# EAGLE schematic controller-teensy-4 (EAGLE 6.4)
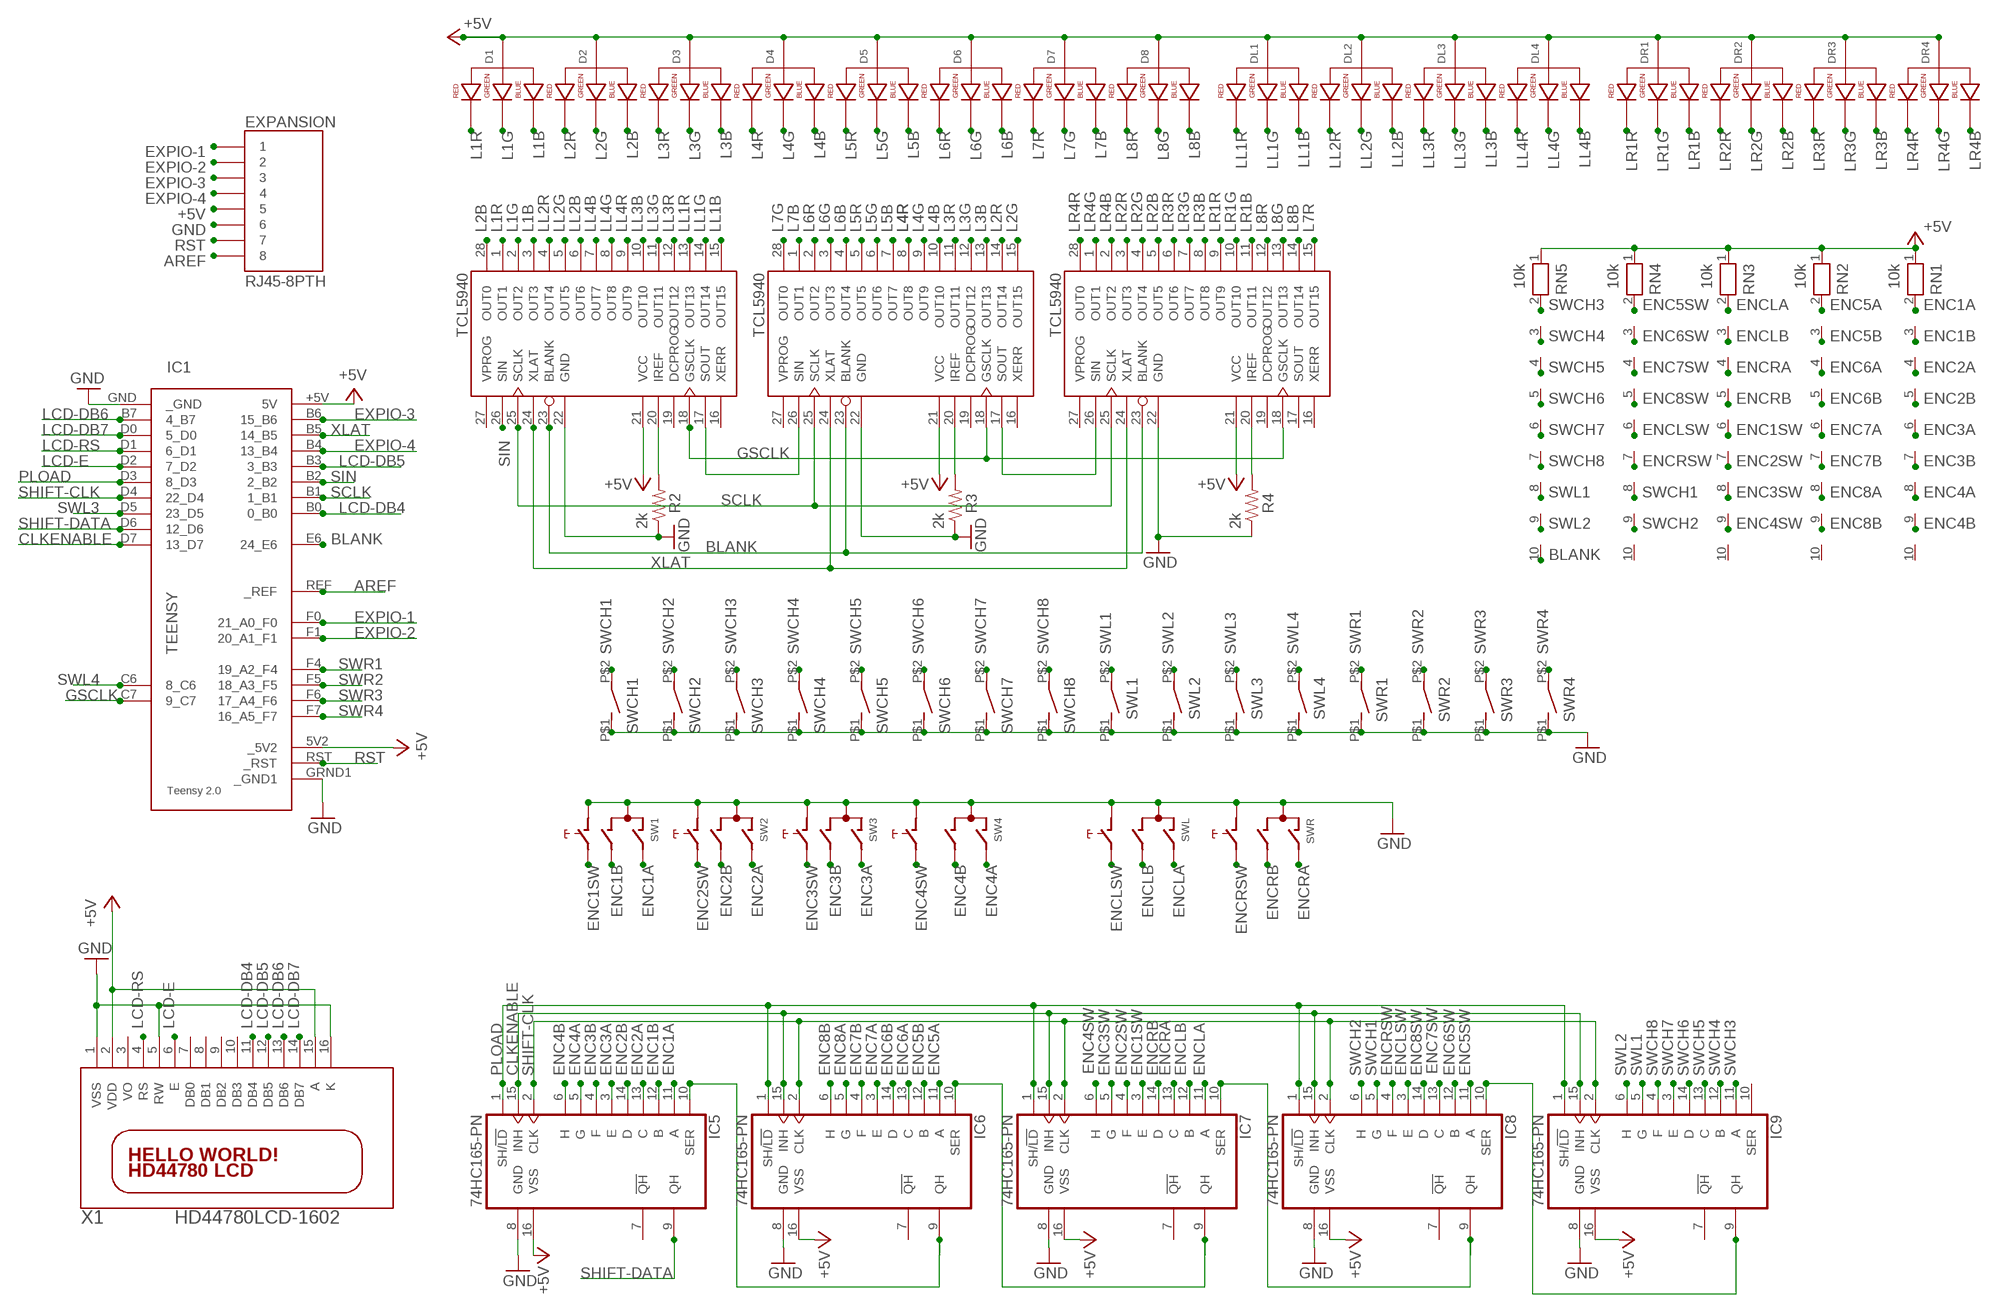
[diagram p0: schematic, sheet 1]

## Parts
D1  LED-RGB-CA-THRUDIFFUSE  [LED-RGB-THRU]
D2  LED-RGB-CA-THRUDIFFUSE  [LED-RGB-THRU]
D3  LED-RGB-CA-THRUDIFFUSE  [LED-RGB-THRU]
D4  LED-RGB-CA-THRUDIFFUSE  [LED-RGB-THRU]
D5  LED-RGB-CA-THRUDIFFUSE  [LED-RGB-THRU]
D6  LED-RGB-CA-THRUDIFFUSE  [LED-RGB-THRU]
D7  LED-RGB-CA-THRUDIFFUSE  [LED-RGB-THRU]
D8  LED-RGB-CA-THRUDIFFUSE  [LED-RGB-THRU]
DL1  LED-RGB-CA-THRUDIFFUSE  [LED-RGB-THRU]
DL2  LED-RGB-CA-THRUDIFFUSE  [LED-RGB-THRU]
DL3  LED-RGB-CA-THRUDIFFUSE  [LED-RGB-THRU]
DL4  LED-RGB-CA-THRUDIFFUSE  [LED-RGB-THRU]
DR1  LED-RGB-CA-THRUDIFFUSE  [LED-RGB-THRU]
DR2  LED-RGB-CA-THRUDIFFUSE  [LED-RGB-THRU]
DR3  LED-RGB-CA-THRUDIFFUSE  [LED-RGB-THRU]
DR4  LED-RGB-CA-THRUDIFFUSE  [LED-RGB-THRU]
EXPANSION  RJ45-8PTH  [RJ45-8]
IC1  TEENSY  [TEENSY]
IC2  LEDPWM1  TCL5940  [DIP28]
IC3  LEDPWM2  TCL5940  [DIP28]
IC4  LEDPWM3  TCL5940  [DIP28]
IC5  74HC165-PN  [DIL16]
IC6  74HC165-PN  [DIL16]
IC7  74HC165-PN  [DIL16]
IC8  74HC165-PN  [DIL16]
IC9  74HC165-PN  [DIL16]
R2  2k  R-US_0207/10  [0207/10]
R3  2k  R-US_0207/10  [0207/10]
R4  2k  R-US_0207/10  [0207/10]
RN1  10k  RN09  [RN-10]
RN2  10k  RN09  [RN-10]
RN3  10k  RN09  [RN-10]
RN4  10k  RN09  [RN-10]
RN5  10k  RN09  [RN-10]
SW1  EC12E_SW  [ALPS_EC12E_SW]
SW2  EC12E_SW  [ALPS_EC12E_SW]
SW3  EC12E_SW  [ALPS_EC12E_SW]
SW4  EC12E_SW  [ALPS_EC12E_SW]
SWCH1  BPM  [BMP]
SWCH2  BPM  [BMP]
SWCH3  BPM  [BMP]
SWCH4  BPM  [BMP]
SWCH5  BPM  [BMP]
SWCH6  BPM  [BMP]
SWCH7  BPM  [BMP]
SWCH8  BPM  [BMP]
SWL  EC12E_SW  [ALPS_EC12E_SW]
SWL1  BPM  [BMP]
SWL2  BPM  [BMP]
SWL3  BPM  [BMP]
SWL4  BPM  [BMP]
SWR  EC12E_SW  [ALPS_EC12E_SW]
SWR1  BPM  [BMP]
SWR2  BPM  [BMP]
SWR3  BPM  [BMP]
SWR4  BPM  [BMP]
X1  HD44780LCD-1602  [LCD1602]

## Nets
+5V: D1.2(ANODE) D2.2(ANODE) D3.2(ANODE) D4.2(ANODE) D5.2(ANODE) D6.2(ANODE) D7.2(ANODE) D8.2(ANODE) DL1.2(ANODE) DL2.2(ANODE) DL3.2(ANODE) DL4.2(ANODE) DR1.2(ANODE) DR2.2(ANODE) DR3.2(ANODE) DR4.2(ANODE) EXPANSION.5 IC1.5V2(_5V2) IC1.+5V(5V) IC2.21(VCC) IC3.21(VCC) IC4.21(VCC) IC5.16(VSS) IC6.16(VSS) IC7.16(VSS) IC8.16(VSS) IC9.16(VSS) RN1.1 RN2.1 RN3.1 RN4.1 RN5.1 X1.2(VDD) X1.15(A)
AREF: EXPANSION.8 IC1.REF(_REF)
BLANK: IC1.E6(24_E6) IC2.23(BLANK) IC3.23(BLANK) IC4.23(BLANK) RN5.10
CLKENABLE: IC1.D7(13_D7) IC5.15(INH) IC6.15(INH) IC7.15(INH) IC8.15(INH) IC9.15(INH)
ENC1A: IC5.11(A) RN1.2 SW1.A
ENC1B: IC5.12(B) RN1.3 SW1.B
ENC1SW: IC7.3(E) RN3.6 SW1.E
ENC2A: IC5.13(C) RN1.4 SW2.A
ENC2B: IC5.14(D) RN1.5 SW2.B
ENC2SW: IC7.4(F) RN3.7 SW2.E
ENC3A: IC5.3(E) RN1.6 SW3.A
ENC3B: IC5.4(F) RN1.7 SW3.B
ENC3SW: IC7.5(G) RN3.8 SW3.E
ENC4A: IC5.5(G) RN1.8 SW4.A
ENC4B: IC5.6(H) RN1.9 SW4.B
ENC4SW: IC7.6(H) RN3.9 SW4.E
ENC5A: IC6.11(A) RN2.2
ENC5B: IC6.12(B) RN2.3
ENC5SW: IC8.11(A) RN4.2
ENC6A: IC6.13(C) RN2.4
ENC6B: IC6.14(D) RN2.5
ENC6SW: IC8.12(B) RN4.3
ENC7A: IC6.3(E) RN2.6
ENC7B: IC6.4(F) RN2.7
ENC7SW: IC8.13(C) RN4.4
ENC8A: IC6.5(G) RN2.8
ENC8B: IC6.6(H) RN2.9
ENC8SW: IC8.14(D) RN4.5
ENCLA: IC7.11(A) RN3.2 SWL.A
ENCLB: IC7.12(B) RN3.3 SWL.B
ENCLSW: IC8.3(E) RN4.6 SWL.E
ENCRA: IC7.13(C) RN3.4 SWR.A
ENCRB: IC7.14(D) RN3.5 SWR.B
ENCRSW: IC8.4(F) RN4.7 SWR.E
EXPIO-1: EXPANSION.1 IC1.F0(21_A0_F0)
EXPIO-2: EXPANSION.2 IC1.F1(20_A1_F1)
EXPIO-3: EXPANSION.3 IC1.B6(15_B6)
EXPIO-4: EXPANSION.4 IC1.B4(13_B4)
GND: EXPANSION.6 IC1.GND(_GND) IC1.GRND1(_GND1) IC2.22(GND) IC3.22(GND) IC4.22(GND) IC5.8(GND) IC6.8(GND) IC7.8(GND) IC8.8(GND) IC9.8(GND) R2.1 R3.1 R4.1 SW1.C SW1.D SW2.C SW2.D SW3.C SW3.D SW4.C SW4.D SWCH1.P$1 SWCH2.P$1 SWCH3.P$1 SWCH4.P$1 SWCH5.P$1 SWCH6.P$1 SWCH7.P$1 SWCH8.P$1 SWL1.P$1 SWL2.P$1 SWL3.P$1 SWL4.P$1 SWL.C SWL.D SWR1.P$1 SWR2.P$1 SWR3.P$1 SWR4.P$1 SWR.C SWR.D X1.1(VSS) X1.5(RW) X1.16(K)
GSCLK: IC1.C7(9_C7) IC2.18(GSCLK) IC3.18(GSCLK) IC4.18(GSCLK)
IC6-IC5: IC5.10(SER) IC6.9(QH)
IC7-IC6: IC6.10(SER) IC7.9(QH)
IC8-IC7: IC7.10(SER) IC8.9(QH)
IC9-IC8: IC8.10(SER) IC9.9(QH)
L1B: D1.4(BLUE_CATHODE) IC2.3(OUT3)
L1G: D1.3(GREEN_CATHODE) IC2.2(OUT2)
L1R: D1.1(RED_CATHODE) IC2.1(OUT1)
L2B: D2.4(BLUE_CATHODE) IC2.28(OUT0)
L2G: D2.3(GREEN_CATHODE) IC3.15(OUT15)
L2R: D2.1(RED_CATHODE) IC3.14(OUT14)
L3B: D3.4(BLUE_CATHODE) IC3.13(OUT13)
L3G: D3.3(GREEN_CATHODE) IC3.12(OUT12)
L3R: D3.1(RED_CATHODE) IC3.11(OUT11)
L4B: D4.4(BLUE_CATHODE) IC3.10(OUT10)
L4G: D4.3(GREEN_CATHODE) IC3.9(OUT9)
L4R: D4.1(RED_CATHODE) IC3.8(OUT8)
L5B: D5.4(BLUE_CATHODE) IC3.7(OUT7)
L5G: D5.3(GREEN_CATHODE) IC3.6(OUT6)
L5R: D5.1(RED_CATHODE) IC3.5(OUT5)
L6B: D6.4(BLUE_CATHODE) IC3.4(OUT4)
L6G: D6.3(GREEN_CATHODE) IC3.3(OUT3)
L6R: D6.1(RED_CATHODE) IC3.2(OUT2)
L7B: D7.4(BLUE_CATHODE) IC3.1(OUT1)
L7G: D7.3(GREEN_CATHODE) IC3.28(OUT0)
L7R: D7.1(RED_CATHODE) IC4.15(OUT15)
L8B: D8.4(BLUE_CATHODE) IC4.14(OUT14)
L8G: D8.3(GREEN_CATHODE) IC4.13(OUT13)
L8R: D8.1(RED_CATHODE) IC4.12(OUT12)
LCD-DB4: IC1.B0(0_B0) X1.11(DB4)
LCD-DB5: IC1.B3(3_B3) X1.12(DB5)
LCD-DB6: IC1.B7(4_B7) X1.13(DB6)
LCD-DB7: IC1.D0(5_D0) X1.14(DB7)
LCD-E: IC1.D2(7_D2) X1.6(E)
LCD-RS: IC1.D1(6_D1) X1.4(RS)
LL1B: DL1.4(BLUE_CATHODE) IC2.15(OUT15)
LL1G: DL1.3(GREEN_CATHODE) IC2.14(OUT14)
LL1R: DL1.1(RED_CATHODE) IC2.13(OUT13)
LL2B: DL2.4(BLUE_CATHODE) IC2.6(OUT6)
LL2G: DL2.3(GREEN_CATHODE) IC2.5(OUT5)
LL2R: DL2.1(RED_CATHODE) IC2.4(OUT4)
LL3B: DL3.4(BLUE_CATHODE) IC2.10(OUT10)
LL3G: DL3.3(GREEN_CATHODE) IC2.11(OUT11)
LL3R: DL3.1(RED_CATHODE) IC2.12(OUT12)
LL4B: DL4.4(BLUE_CATHODE) IC2.7(OUT7)
LL4G: DL4.3(GREEN_CATHODE) IC2.8(OUT8)
LL4R: DL4.1(RED_CATHODE) IC2.9(OUT9)
LR1B: DR1.4(BLUE_CATHODE) IC4.11(OUT11)
LR1G: DR1.3(GREEN_CATHODE) IC4.10(OUT10)
LR1R: DR1.1(RED_CATHODE) IC4.9(OUT9)
LR2B: DR2.4(BLUE_CATHODE) IC4.5(OUT5)
LR2G: DR2.3(GREEN_CATHODE) IC4.4(OUT4)
LR2R: DR2.1(RED_CATHODE) IC4.3(OUT3)
LR3B: DR3.4(BLUE_CATHODE) IC4.8(OUT8)
LR3G: DR3.3(GREEN_CATHODE) IC4.7(OUT7)
LR3R: DR3.1(RED_CATHODE) IC4.6(OUT6)
LR4B: DR4.4(BLUE_CATHODE) IC4.2(OUT2)
LR4G: DR4.3(GREEN_CATHODE) IC4.1(OUT1)
LR4R: DR4.1(RED_CATHODE) IC4.28(OUT0)
N$10: IC3.20(IREF) R3.2
N$13: IC2.20(IREF) R2.2
N$14: IC2.17(SOUT) IC3.26(SIN)
N$15: IC3.17(SOUT) IC4.26(SIN)
N$16: IC4.20(IREF) R4.2
PLOAD: IC1.D3(8_D3) IC5.1(SH/!LD) IC6.1(SH/!LD) IC7.1(SH/!LD) IC8.1(SH/!LD) IC9.1(SH/!LD)
RST: EXPANSION.7 IC1.RST(_RST)
SCLK: IC1.B1(1_B1) IC2.25(SCLK) IC3.25(SCLK) IC4.25(SCLK)
SHIFT-CLK: IC1.D4(22_D4) IC5.2(CLK) IC6.2(CLK) IC7.2(CLK) IC8.2(CLK) IC9.2(CLK)
SHIFT-DATA: IC1.D6(12_D6) IC5.9(QH)
SIN: IC1.B2(2_B2) IC2.26(SIN)
SWCH1: IC8.5(G) RN4.8 SWCH1.P$2
SWCH2: IC8.6(H) RN4.9 SWCH2.P$2
SWCH3: IC9.11(A) RN5.2 SWCH3.P$2
SWCH4: IC9.12(B) RN5.3 SWCH4.P$2
SWCH5: IC9.13(C) RN5.4 SWCH5.P$2
SWCH6: IC9.14(D) RN5.5 SWCH6.P$2
SWCH7: IC9.3(E) RN5.6 SWCH7.P$2
SWCH8: IC9.4(F) RN5.7 SWCH8.P$2
SWL1: IC9.5(G) RN5.8 SWL1.P$2
SWL2: IC9.6(H) RN5.9 SWL2.P$2
SWL3: IC1.D5(23_D5) SWL3.P$2
SWL4: IC1.C6(8_C6) SWL4.P$2
SWR1: IC1.F4(19_A2_F4) SWR1.P$2
SWR2: IC1.F5(18_A3_F5) SWR2.P$2
SWR3: IC1.F6(17_A4_F6) SWR3.P$2
SWR4: IC1.F7(16_A5_F7) SWR4.P$2
XLAT: IC1.B5(14_B5) IC2.24(XLAT) IC3.24(XLAT) IC4.24(XLAT)
Unconnected: IC2.16(XERR) IC2.19(DCPROG) IC2.27(VPROG) IC3.16(XERR) IC3.19(DCPROG) IC3.27(VPROG) IC4.16(XERR) IC4.17(SOUT) IC4.19(DCPROG) IC4.27(VPROG) IC5.7(!QH) IC6.7(!QH) IC7.7(!QH) IC8.7(!QH) IC9.7(!QH) IC9.10(SER) RN1.10 RN2.10 RN3.10 RN4.10 SW1.GND1(G) SW1.GND2(G) SW2.GND1(G) SW2.GND2(G) SW3.GND1(G) SW3.GND2(G) SW4.GND1(G) SW4.GND2(G) SWL.GND1(G) SWL.GND2(G) SWR.GND1(G) SWR.GND2(G) X1.3(VO) X1.7(DB0) X1.8(DB1) X1.9(DB2) X1.10(DB3)

## Library data of the parts
D1-D8 DL1-DL4 DR1-DR4 = SparkFun-LED:LED-RGB-CA-THRU: RGB Through-hole common anode SparkFun store front COM-10821 (diffuse) COM-10820 (clear); PROD_ID: DIO-10632
EXPANSION = SparkFun:RJ45-8: RJ45 Jack Simple RJ45, 8-pin connection - connector for common Cat5, Cat5e, and Cat6 Ethernet cables. Footprint not yet proven in production. Connector sku is PRT-00643; Breakout PCB sku is BOB-00716.
IC1 = teensy:TEENSY: Teensy 2.0 Original Design by Clint Fisher Modified Design by Tamir Emran Licensed Under Creative Commons Attribution-ShareAlike 3.0 Unported (CC BY-SA 3.0)
IC2-IC4 = tcl5940:TCL5940: 16-Channel 12-Bit LED Driver
IC5-IC9 = 74xx-us:74*165-P: 8-bit parallel load SHIFT REGISTER; PWR: 1
R2-R4 = resistor:R-US_: RESISTOR, American symbol
RN1-RN5 = resistor-net:RN09: RESISTOR NETWORK; OC_FARNELL: unknown; OC_NEWARK: unknown
SW1-SW4 SWL SWR = switch-alps:EC12E_SW: ALPS rotary Encoder EC12E series with switch; MPN: EC12E2424407; OC_FARNELL: 1520813; OC_NEWARK: 74M1068
SWCH1-SWCH8 SWL1-SWL4 SWR1-SWR4 = livid:BPM
X1 = adafruit:HD44780LCD: HD44780 LCD Standard character type LCDs, available in sizes from 8x1 to 40x4!